# EAGLE schematic Top PCB1 (EAGLE 9.1.0)

## Sheet 1 of 5
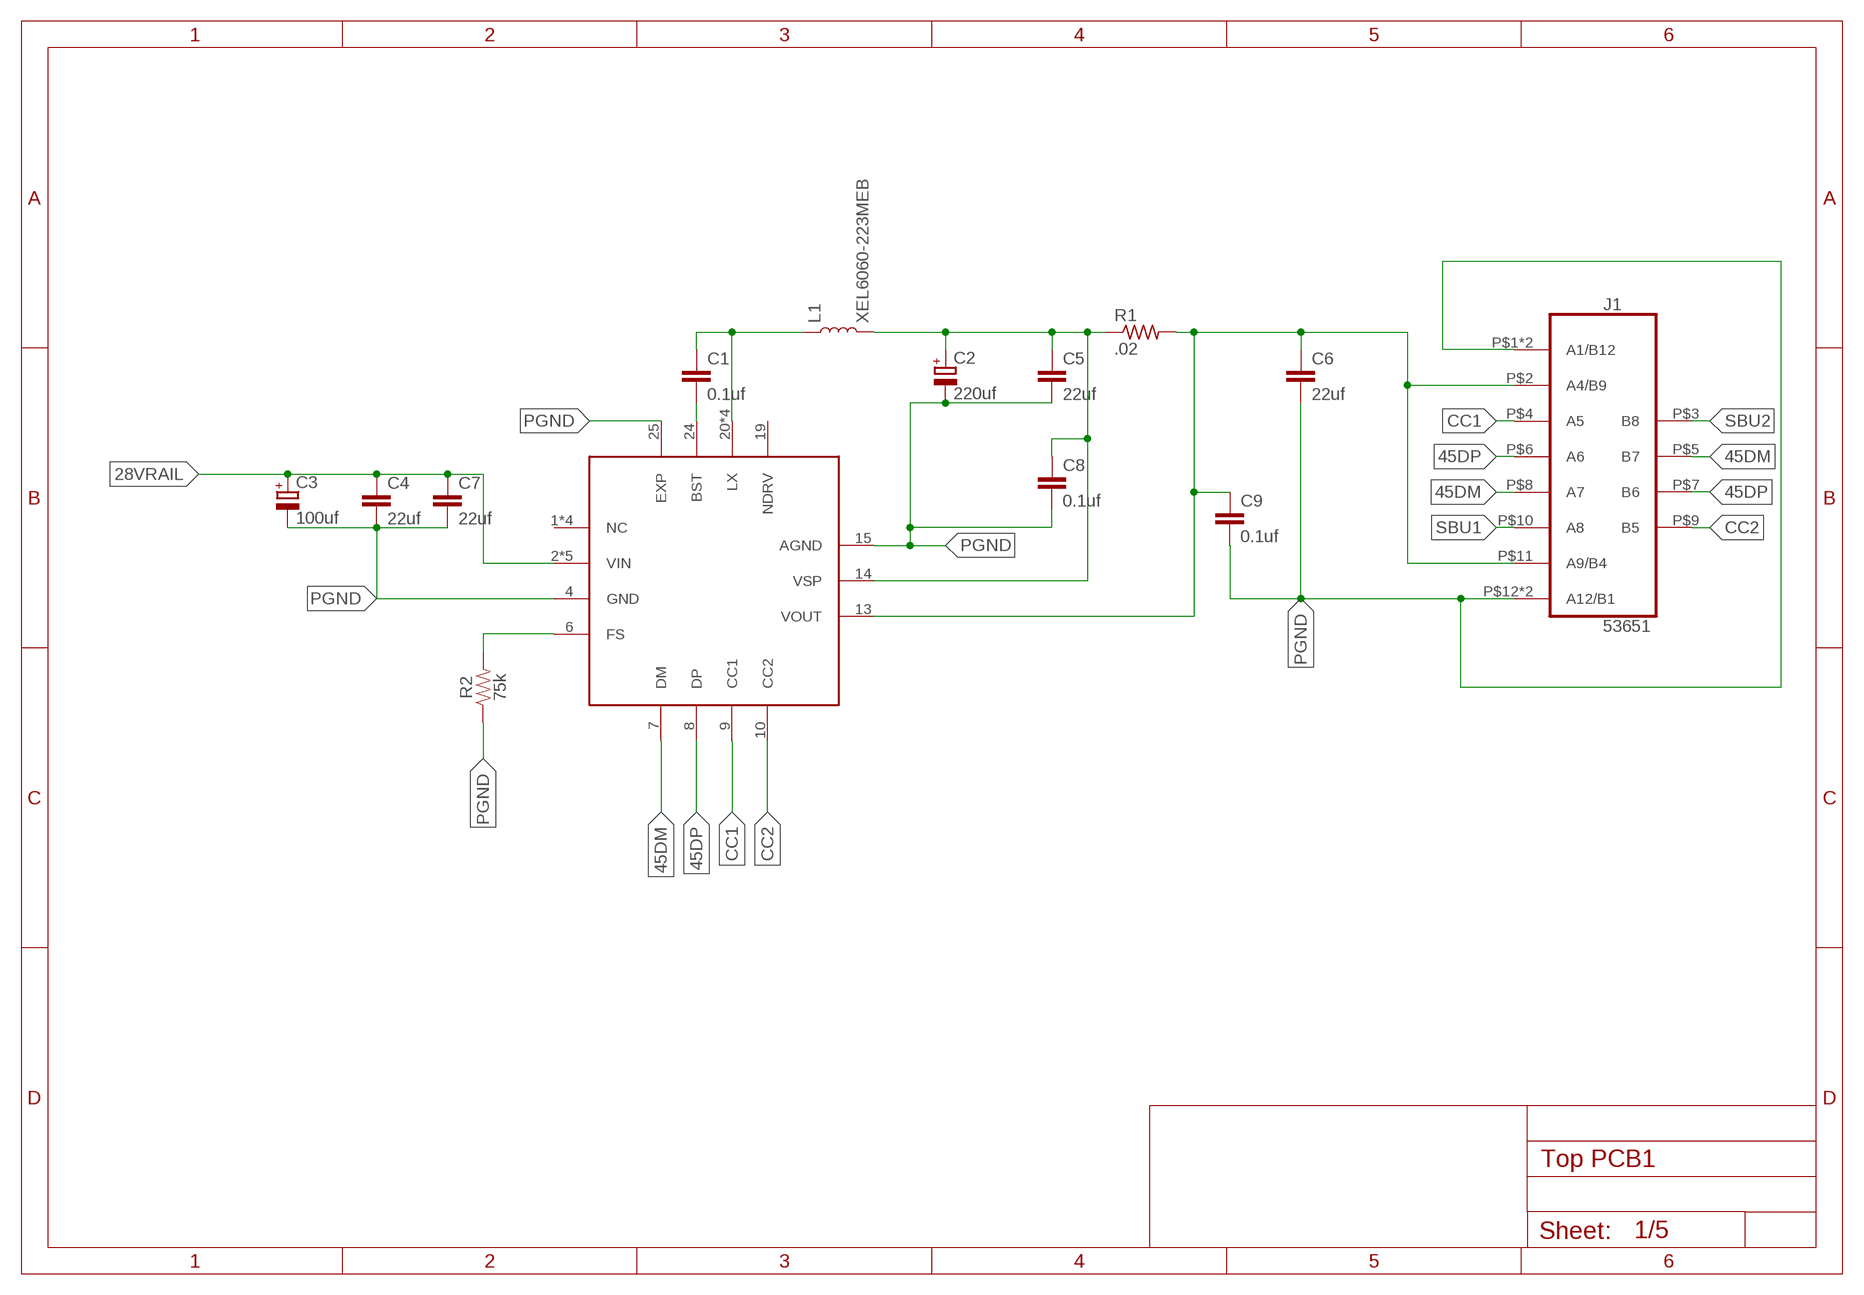
[diagram p0: schematic, sheet 1]

### Parts
C1  0.1uf  C-EUC0805K  [C0805K]
C2  220uf  EMZR250ARA221MF80G  [CAPAE660X800]
C3  100uf  EMZR250ARA221MF80G  [CAPAE660X800]
C4  22uf  C-EUC0805K  [C0805K]
C5  22uf  C-EUC0805K  [C0805K]
C6  22uf  C-EUC0805K  [C0805K]
C7  22uf  C-EUC0805K  [C0805K]
C8  0.1uf  C-EUC0805K  [C0805K]
C9  0.1uf  C-EUC0805K  [C0805K]
J1  53651  [53651]
L1  XEL6060-223MEB  XEL6060-222MEB  [RESM6365X610]
R1  .02  R-US_R0805  [R0805]
R2  75k  RES4K04020402  [0402]
U1  IP6518  [QFN50P400X400X80-25T250]

### Nets
28VRAIL: C3.1(+) C4.1 C7.1 U1.2(VIN) U1.3(VIN) U1.16(VIN) U1.17(VIN) U1.18(VIN)
45DM: J1.P$5(B7) J1.P$8(A7) U1.7(DM)
45DP: J1.P$6(A6) J1.P$7(B6) U1.8(DP)
CC1: J1.P$4(A5) U1.9(CC1)
CC2: J1.P$9(B5) U1.10(CC2)
N$1: C1.1 L1.1 U1.20(LX) U1.21(LX) U1.22(LX) U1.23(LX)
N$2: C1.2 U1.24(BST)
N$3: C2.1(+) C5.1 C8.1 L1.2 R1.1 U1.14(VSP)
N$5: C6.1 C9.1 J1.P$2(A4/B9) J1.P$11(A9/B4) R1.2 U1.13(VOUT)
N$6: R2.2 U1.6(FS)
PGND: C2.2(-) C3.2(-) C4.2 C5.2 C6.2 C7.2 C8.2 C9.2 J1.P$1(A1/B12) J1.P$12(A12/B1) J1.P$13(A1/B12) J1.P$14(A12/B1) R2.1 U1.4(GND) U1.15(AGND) U1.25(EXP)
SBU1: J1.P$10(A8)
SBU2: J1.P$3(B8)
Unconnected: U1.1(NC) U1.5(NC) U1.11(NC) U1.12(NC) U1.19(NDRV)

## Sheet 2 of 5
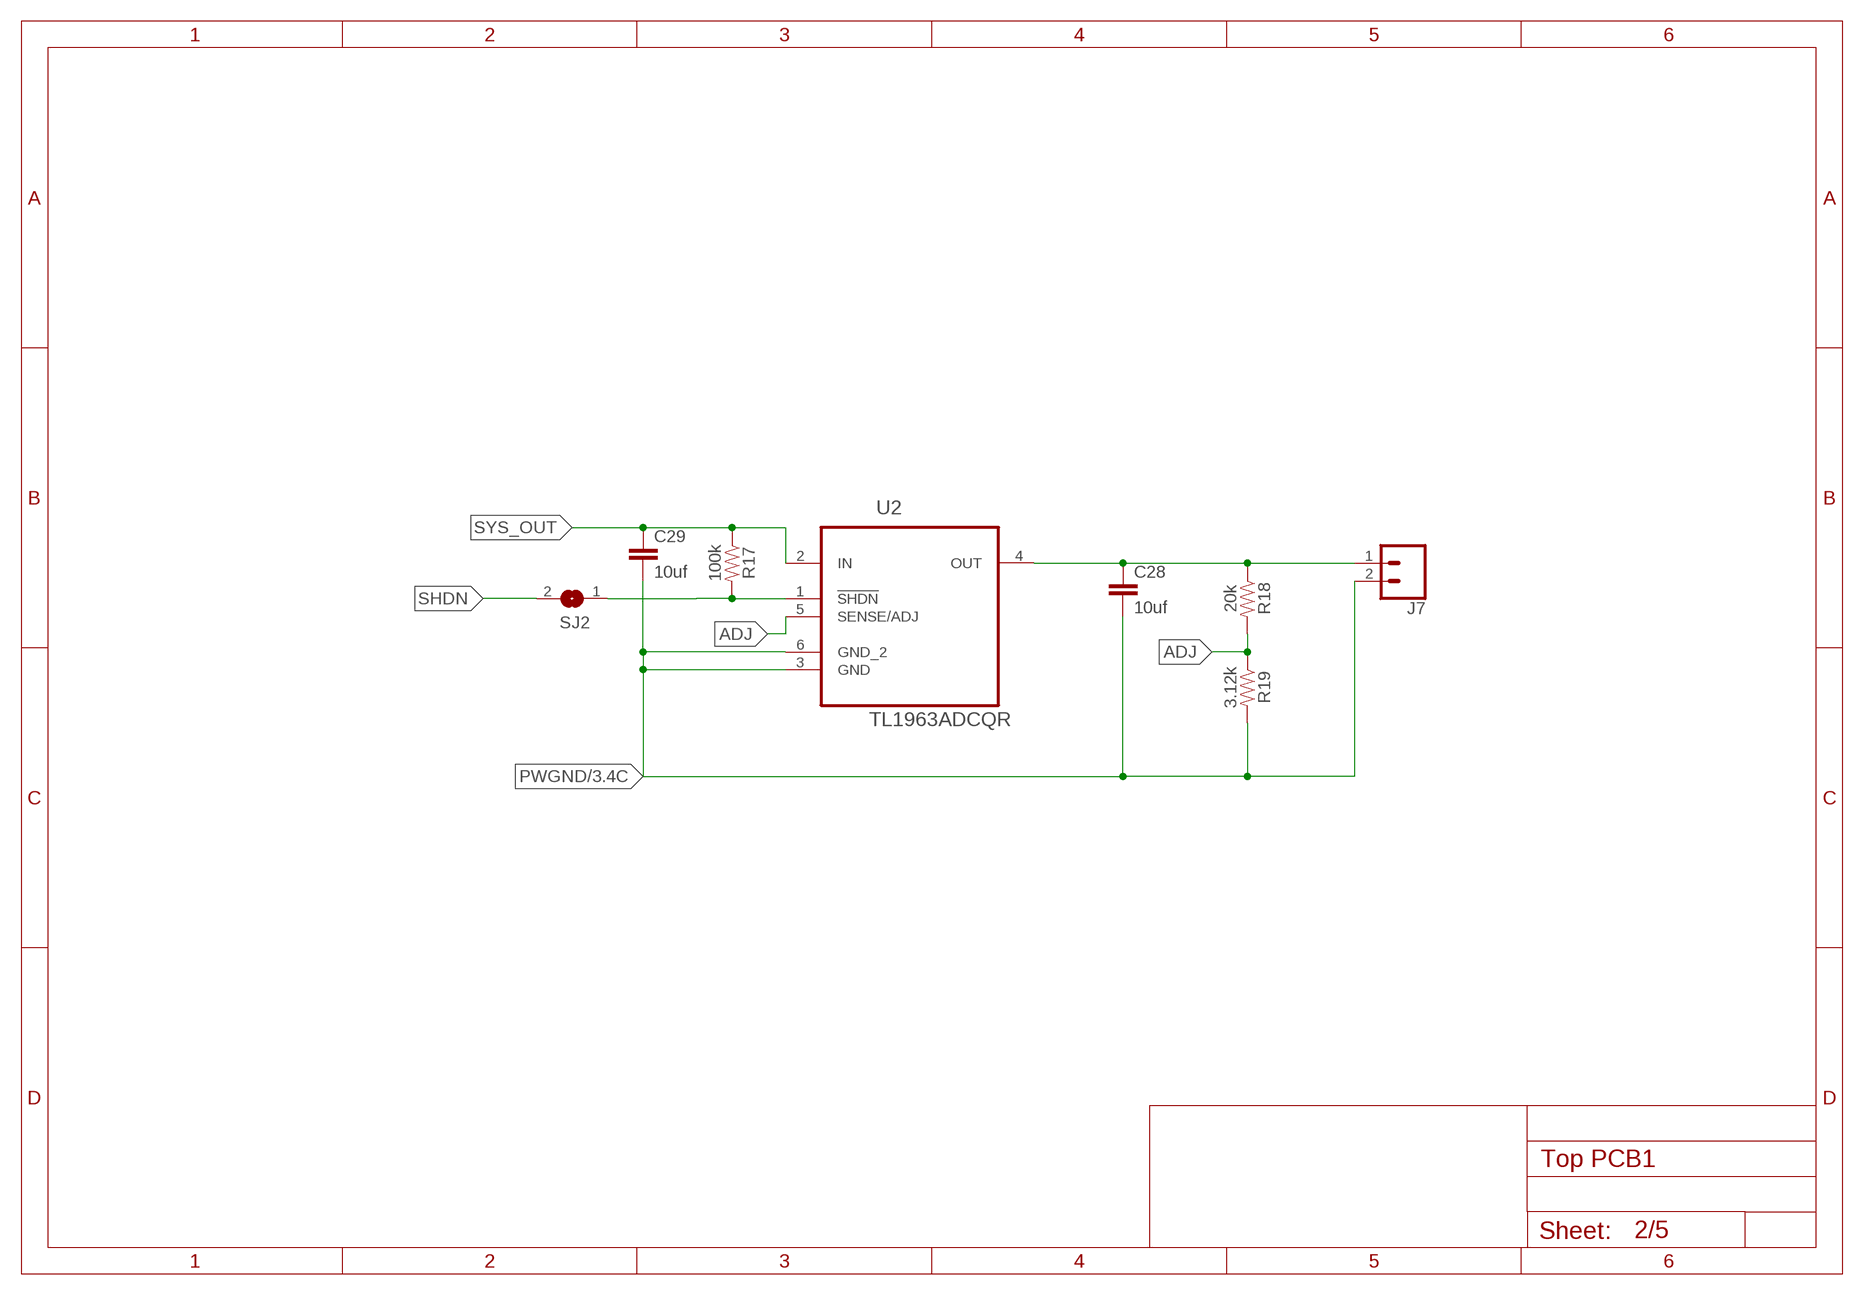
[diagram p1: schematic, sheet 2]

### Parts
C28  10uf  C-EUC0805K  [C0805K]
C29  10uf  C-EUC0805K  [C0805K]
J7  CONN_02  [1X02]
R17  100k  RES4K04020402  [0402]
R18  20k  RES4K04020402  [0402]
R19  3.12k  RES4K04020402  [0402]
SJ2  SJ  [SJ]
U2  TL1963ADCQR  [SOT127P706X180-6]

### Nets
ADJ: R18.2 R19.1 U2.5(SENSE/ADJ)
N$23: C28.1 J7.1 R18.1 U2.4(OUT)
N$24: R17.2 SJ2.1 U2.1(!SHDN)
PWGND: C28.2 C29.2 J7.2 R19.2 U2.3(GND) U2.6(GND_2) ; also sheet 3
SHDN: SJ2.2
SYS_OUT: C29.1 R17.1 U2.2(IN)

## Sheet 3 of 5
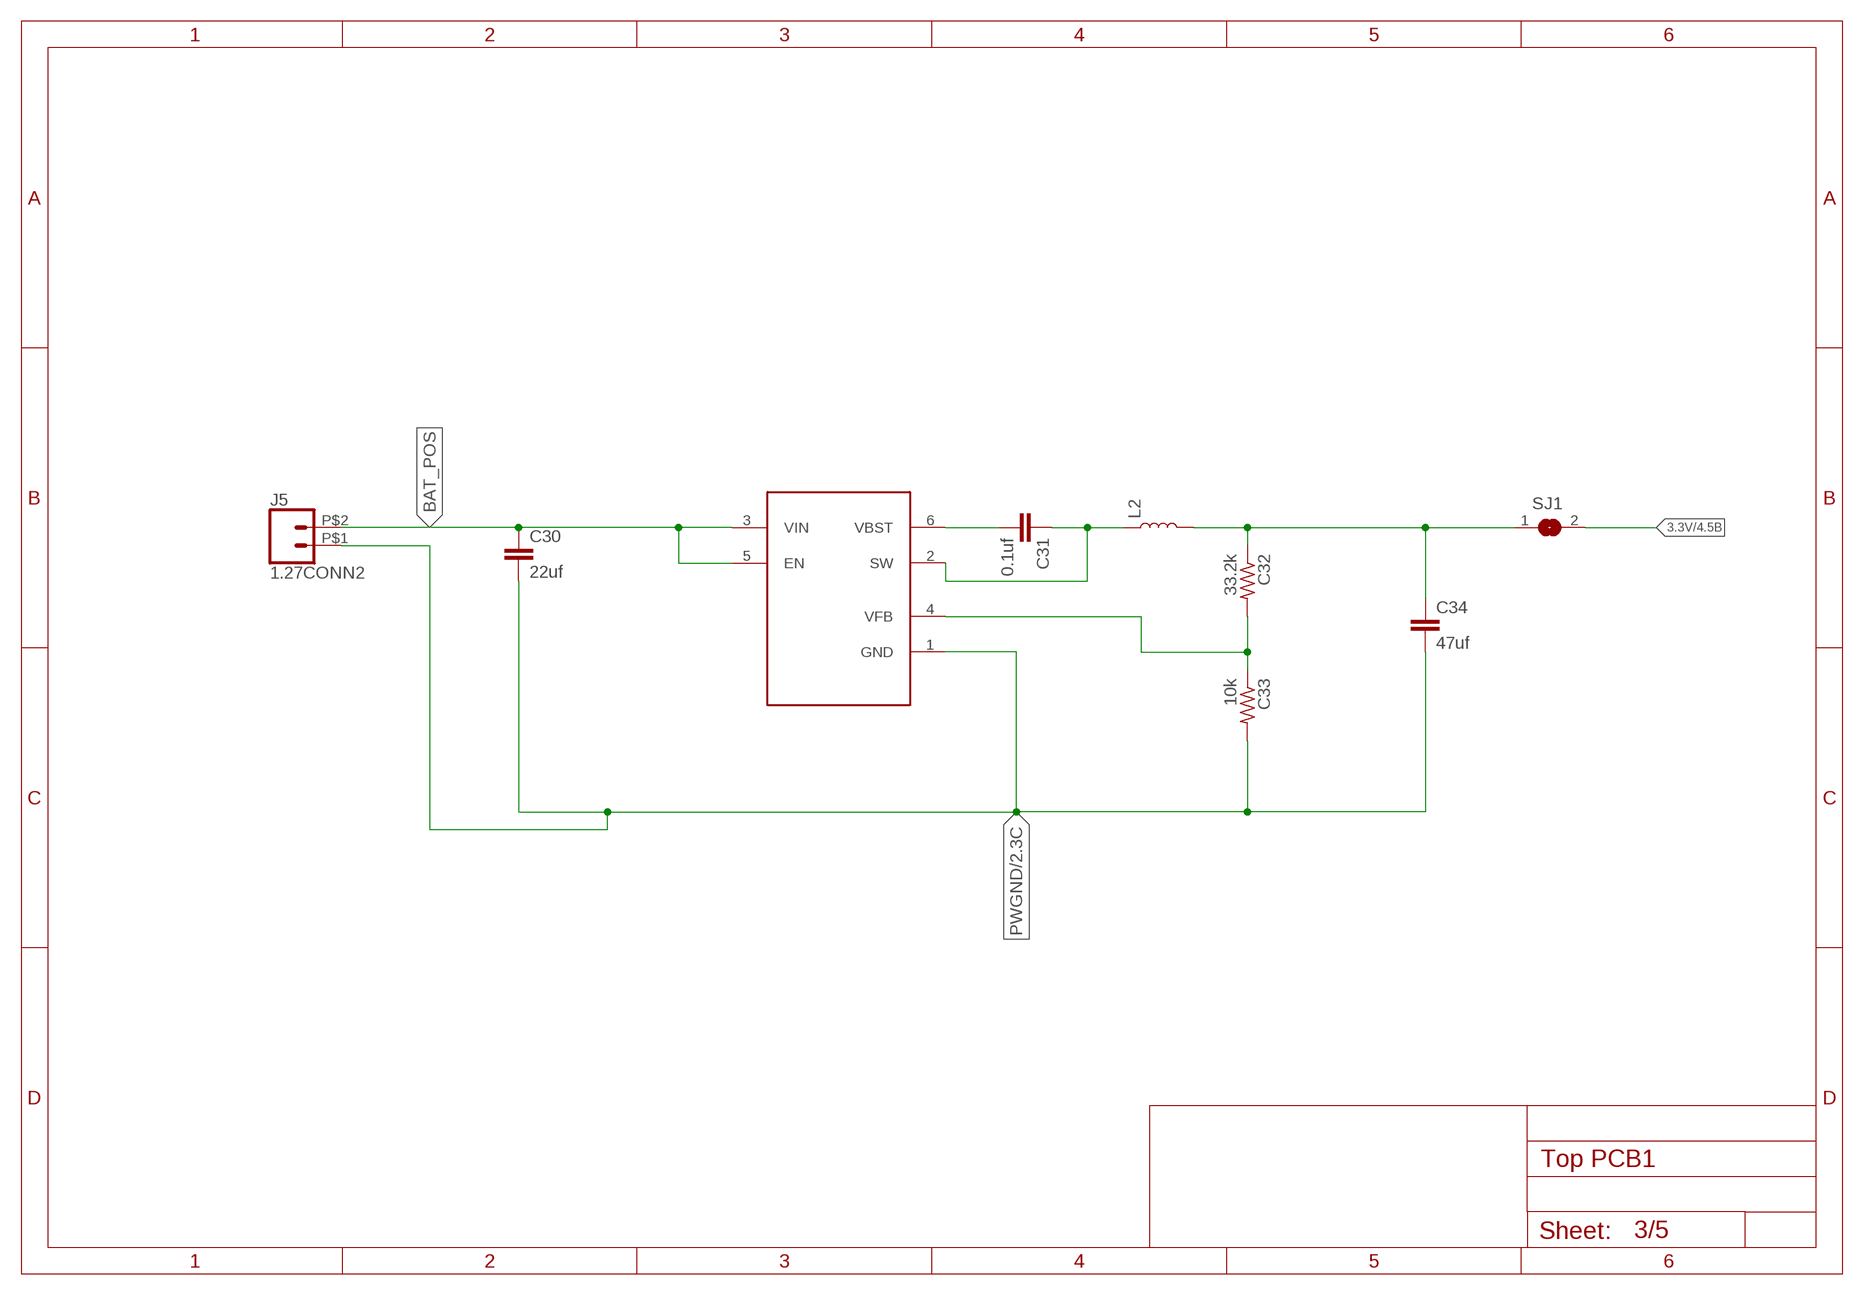
[diagram p2: schematic, sheet 3]

### Parts
C30  22uf  C-EUC1206  [C1206]
C31  0.1uf  CAP0402  [CAPC1005X50]
C32  33.2k  R-US_R0805  [R0805]
C33  10k  R-US_R0603  [R0603]
C34  47uf  C-EUC1206K  [C1206K]
J5  1.27CONN2  [CONN2_1.27]
L2  ASPI-4030S-3R3M-T  [INDDFN400X400X300-2]
SJ1  SJ  [SJ]
U3  TPS561208DDCR  [SOT95P280X110-6]

### Nets
3.3V: SJ1.2 ; also sheet 4
BAT_POS: C30.1 J5.P$2 U3.3(VIN) U3.5(EN)
N$8: C32.1 C34.1 L2.2 SJ1.1
N$21: C31.2 U3.6(VBST)
N$26: C31.1 L2.1 U3.2(SW)
N$28: C32.2 C33.1 U3.4(VFB)
PWGND: C30.2 C33.2 C34.2 J5.P$1 U3.1(GND) ; also sheet 2

## Sheet 4 of 5
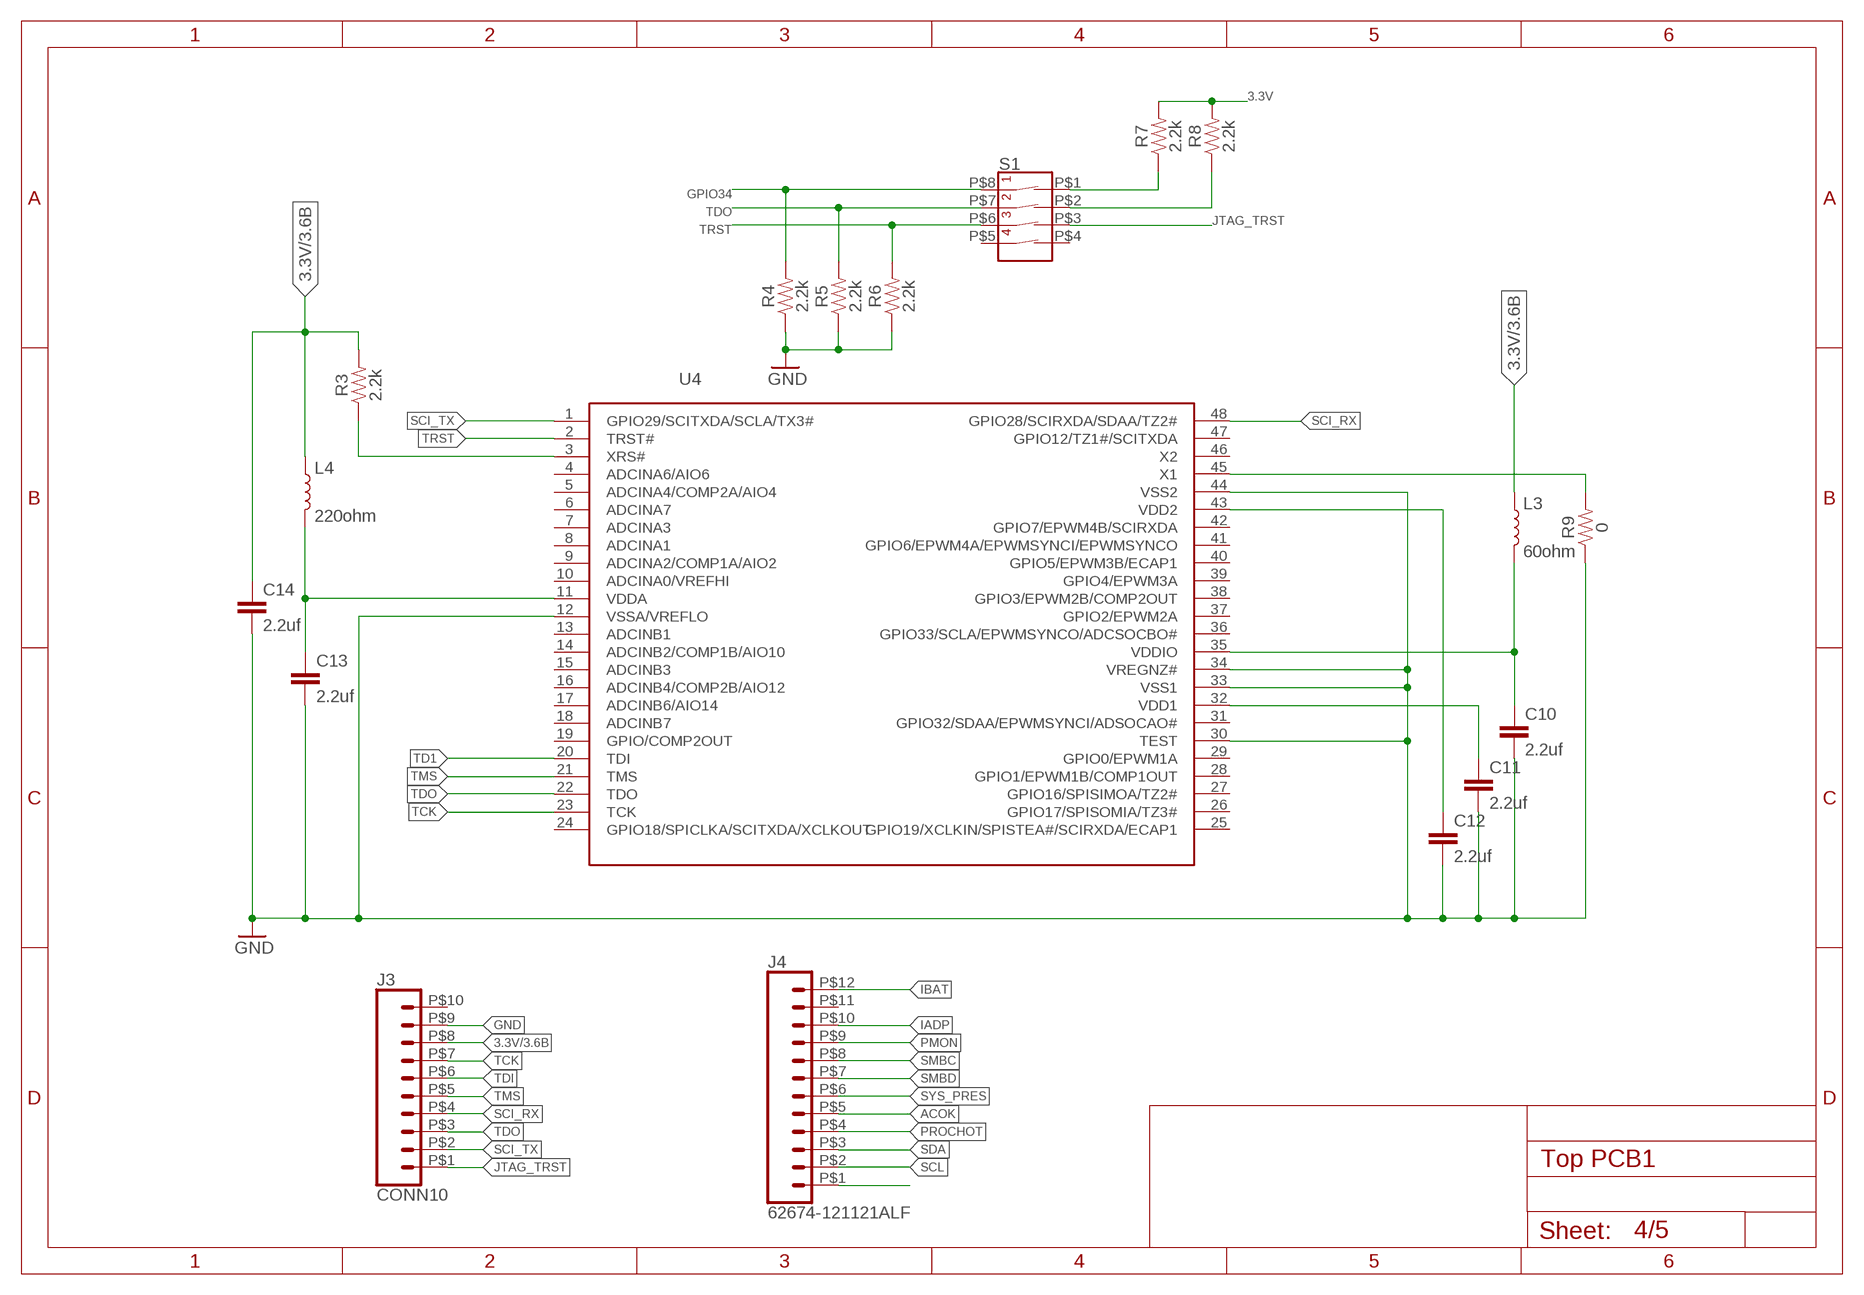
[diagram p3: schematic, sheet 4]

### Parts
C10  2.2uf  C-EUC0402K  [C0402K]
C11  2.2uf  C-EUC0402K  [C0402K]
C12  2.2uf  C-EUC0402K  [C0402K]
C13  2.2uf  C-EUC0402K  [C0402K]
C14  2.2uf  C-EUC0402K  [C0402K]
J3  CONN10  [CONN10_1.27]
J4  62674-121121ALF  [62674-121121ALF]
L3  60ohm  FERRITEBEAD  [BEADC1005X50]
L4  220ohm  FERRITEBEAD  [BEADC1005X50]
R3  2.2k  RES4K04020402  [0402]
R4  2.2k  RES4K04020402  [0402]
R5  2.2k  RES4K04020402  [0402]
R6  2.2k  RES4K04020402  [0402]
R7  2.2k  RES4K04020402  [0402]
R8  2.2k  RES4K04020402  [0402]
R9  0  RES4K04020402  [0402]
S1  DHN-04-V  [DHN-04-V]
U4  TMS320F28027  [QFP50P900X900X145-48]

### Nets
3.3V: C14.1 J3.P$8 L3.1 L4.1 R3.2 R7.2 R8.2 ; also sheet 3
ACOK: J4.P$5
GND: C10.2 C11.2 C12.2 C13.2 C14.2 J3.P$9 R4.1 R5.1 R6.1 R9.1 U4.12(VSSA/VREFLO) U4.30(TEST) U4.33(VSS1) U4.34(VREGNZ#) U4.44(VSS2)
GPIO34: R4.2 S1.P$8(1B)
IADP: J4.P$10
IBAT: J4.P$12
JTAG_TRST: J3.P$1 S1.P$3(3A)
N$4: R9.2 U4.45(X1)
N$7: C10.1 L3.2 U4.35(VDDIO)
N$9: C11.1 U4.32(VDD1)
N$11: C12.1 U4.43(VDD2)
N$13: C13.1 L4.2 U4.11(VDDA)
N$16: R3.1 U4.3(XRS#)
N$18: R7.1 S1.P$1(1A)
N$19: R8.1 S1.P$2(2A)
N$31: J4.P$1
PMON: J4.P$9
PROCHOT: J4.P$4
SCI_RX: J3.P$4 U4.48(GPIO28/SCIRXDA/SDAA/TZ2#)
SCI_TX: J3.P$2 U4.1(GPIO29/SCITXDA/SCLA/TX3#)
SCL: J4.P$2
SDA: J4.P$3
SMBC: J4.P$8
SMBD: J4.P$7
SYS_PRES: J4.P$6
TCK: J3.P$7 U4.23(TCK)
TD1: U4.20(TDI)
TDI: J3.P$6
TDO: J3.P$3 R5.2 S1.P$7(2B) U4.22(TDO)
TMS: J3.P$5 U4.21(TMS)
TRST: R6.2 S1.P$6(3B) U4.2(TRST#)
Unconnected: J3.P$10 J4.P$11 S1.P$4(4A) S1.P$5(4B) U4.4(ADCINA6/AIO6) U4.5(ADCINA4/COMP2A/AIO4) U4.6(ADCINA7) U4.7(ADCINA3) U4.8(ADCINA1) U4.9(ADCINA2/COMP1A/AIO2) U4.10(ADCINA0/VREFHI) U4.13(ADCINB1) U4.14(ADCINB2/COMP1B/AIO10) U4.15(ADCINB3) U4.16(ADCINB4/COMP2B/AIO12) U4.17(ADCINB6/AIO14) U4.18(ADCINB7) U4.19(GPIO/COMP2OUT) U4.24(GPIO18/SPICLKA/SCITXDA/XCLKOUT) U4.25(GPIO19/XCLKIN/SPISTEA#/SCIRXDA/ECAP1) U4.26(GPIO17/SPISOMIA/TZ3#) U4.27(GPIO16/SPISIMOA/TZ2#) U4.28(GPIO1/EPWM1B/COMP1OUT) U4.29(GPIO0/EPWM1A) U4.31(GPIO32/SDAA/EPWMSYNCI/ADSOCAO#) U4.36(GPIO33/SCLA/EPWMSYNCO/ADCSOCBO#) U4.37(GPIO2/EPWM2A) U4.38(GPIO3/EPWM2B/COMP2OUT) U4.39(GPIO4/EPWM3A) U4.40(GPIO5/EPWM3B/ECAP1) U4.41(GPIO6/EPWM4A/EPWMSYNCI/EPWMSYNCO) U4.42(GPIO7/EPWM4B/SCIRXDA) U4.46(X2) U4.47(GPIO12/TZ1#/SCITXDA)

## Sheet 5 of 5
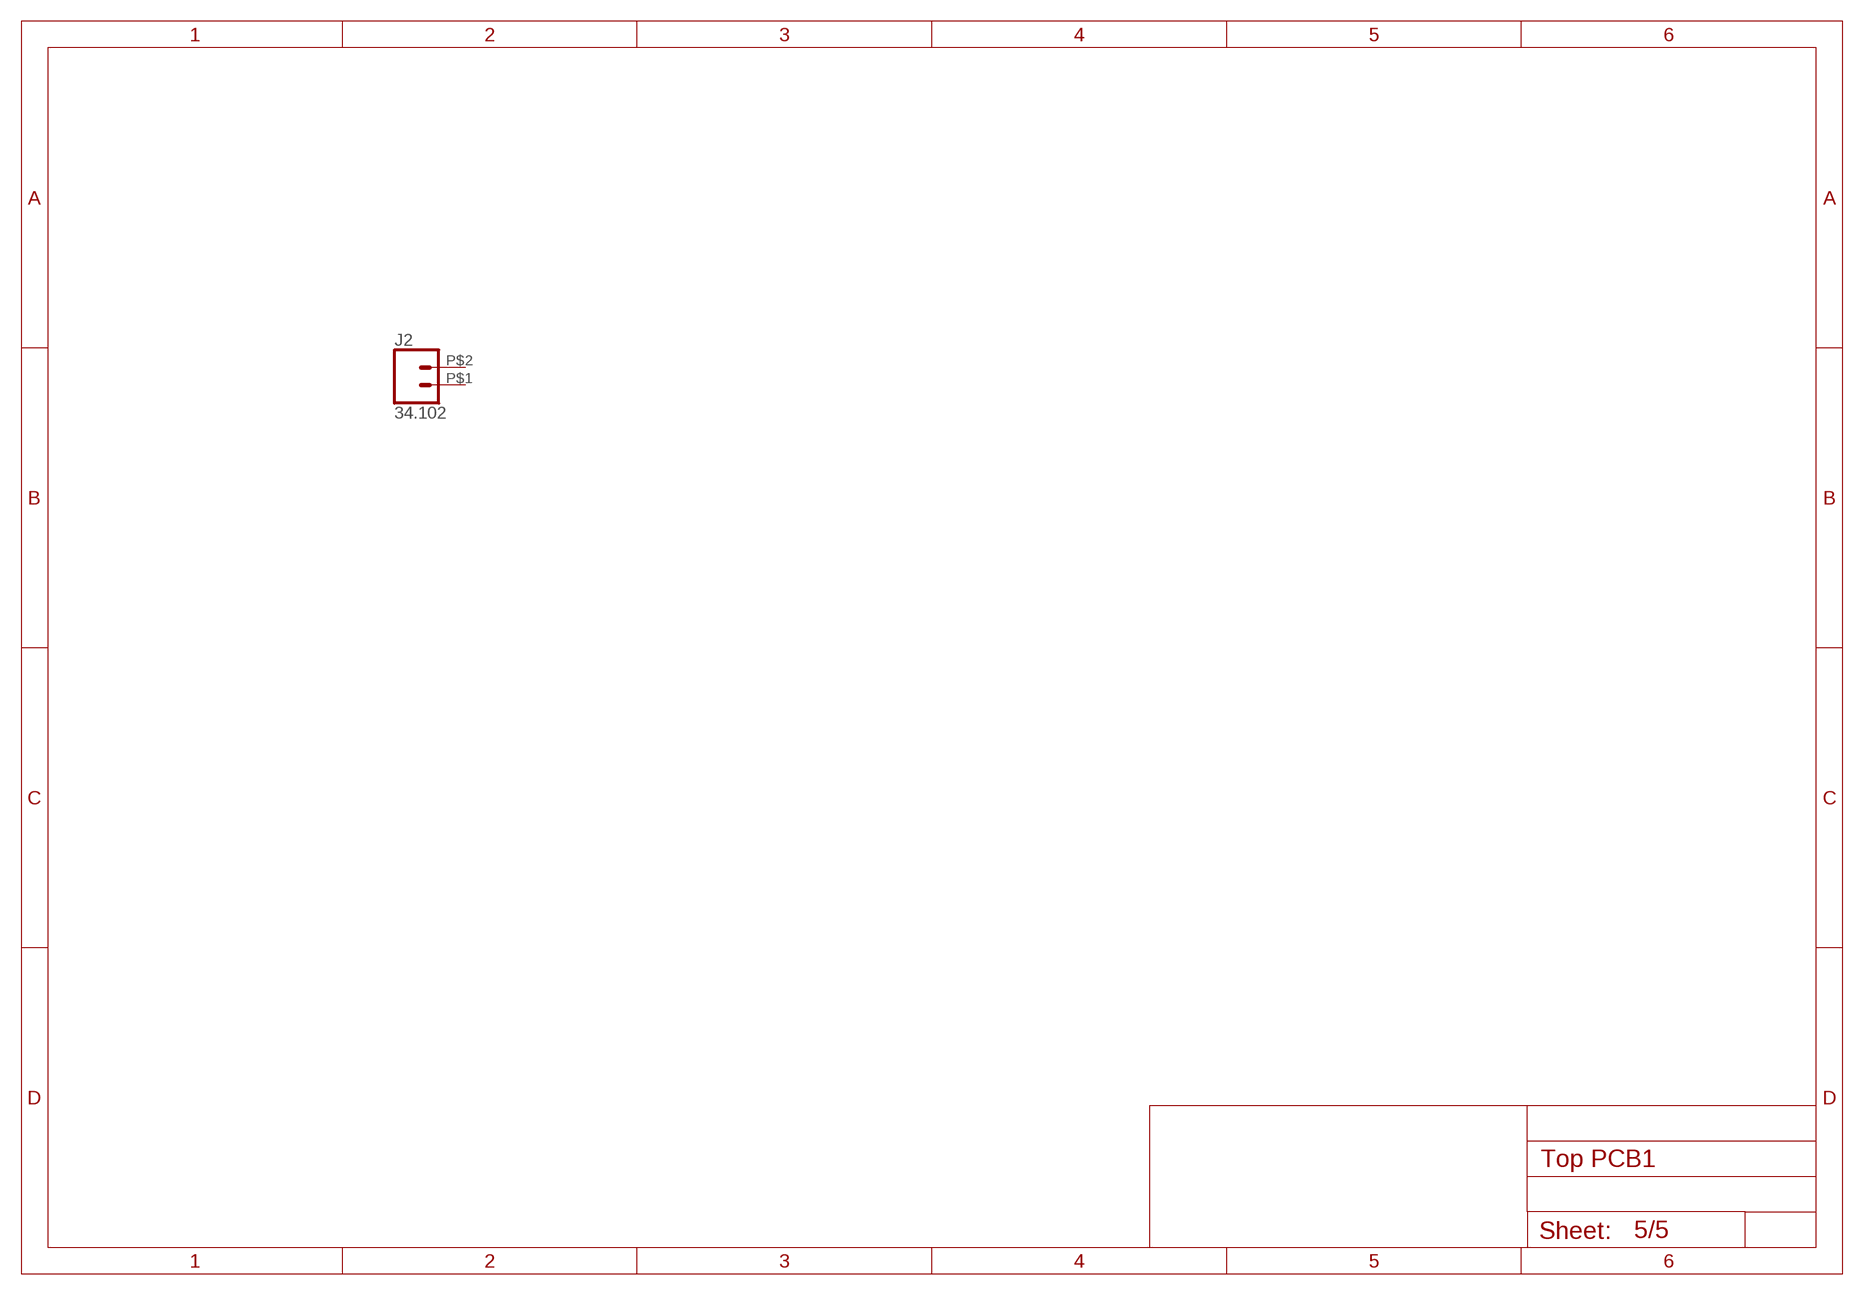
[diagram p4: schematic, sheet 5]

### Parts
J2  34.102  [34.102]
Unconnected: J2.P$1 J2.P$2

## Library data of the parts
C1 C4-C14 C28-C30 C34 = rcl:C-EU: CAPACITOR, European symbol; SPICEPREFIX: C
C2 C3 = BMS:EMZR250ARA221MF80G
C31 = BMS:CAP0402
C32 C33 R1 = rcl:R-US_: RESISTOR, American symbol; SPICEPREFIX: R
J1 = CSD25402Q3A:5365
J2 = CSD25402Q3A:34.102
J3 = BMS:CONN10
J4 = CSD25402Q3A:62674-121121ALF
J5 = BMS:1.27CONN2
J7 = SparkFun-Connectors:CONN_02: Multi connection point. Often used as Generic Header-pin footprint for 0.1 inch spaced/style header connections On any of the 0.1 inch spaced packages, you can populate with these: Break Away Headers - Straight <https://www.sparkfun.com/products/116> (PRT-00116) Break Away Male Headers - Right Angle <https://www.sparkfun.com/products/553> (PRT-00553) Female Headers <https://www.sparkfun.com/products/115> (PRT-00115) Break Away Headers - Machine Pin <https://www.sparkfun.com/products/117> (PRT-00117) Break Away Female Headers - Swiss Machine Pin <https://www.sparkfun.com/products/743> (PRT-00743) For SCREWTERMINALS and SPRING TERMINALS visit here: Screw Terimnals on SparkFun.com <https://www.sparkfun.com/search/results?term=Screw+Terminals> (5mm/3.5mm/2.54mm spacing) This device is also useful as a general connection point to wire up your design to another part of your project. Our various solder wires solder well into these plated through hole pads. Hook-Up Wire - Assortment (Stranded, 22 AWG) <https://www.sparkfun.com/products/11375> (PRT-11375) Hook-Up Wire - Assortment (Solid Core, 22 AWG) <https://www.sparkfun.com/products/11367> (PRT-11367) View the entire wire category on our website here <https://www.sparkfun.com/categories/141> Special notes: Molex polarized connector foot print use with: PRT-08233 with associated crimp pins and housings. 2.54_SCREWTERM for use with PRT-10571. 3.5mm Screw Terminal footprints for PRT-08084 5mm Screw Terminal footprints for use with PRT-08432
L1 = BMS:XEL6060-222MEB
L2 = BMS:ASPI-4030S-3R3M-T
L3 L4 = BMS:FERRITEBEAD
R2-R9 R17-R19 = BMS:RES4K0402
S1 = BMS:DHN-04-V
SJ1 SJ2 = jumper:SJ: SMD solder JUMPER
U1 = BMS:IP6518
U2 = BMS:TL1963ADCQR
U3 = BMS:TPS561208DDCR
U4 = BMS:TMS320F28027